# Altium schematic sheet WiFi Camera Rev 3.1.SchDoc: WiFI Camera
size A2; Revision: Rev 3.1; SheetNumber: 1
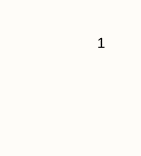
[diagram p0: WiFi Camera Rev 3.1.SchDoc, top right]
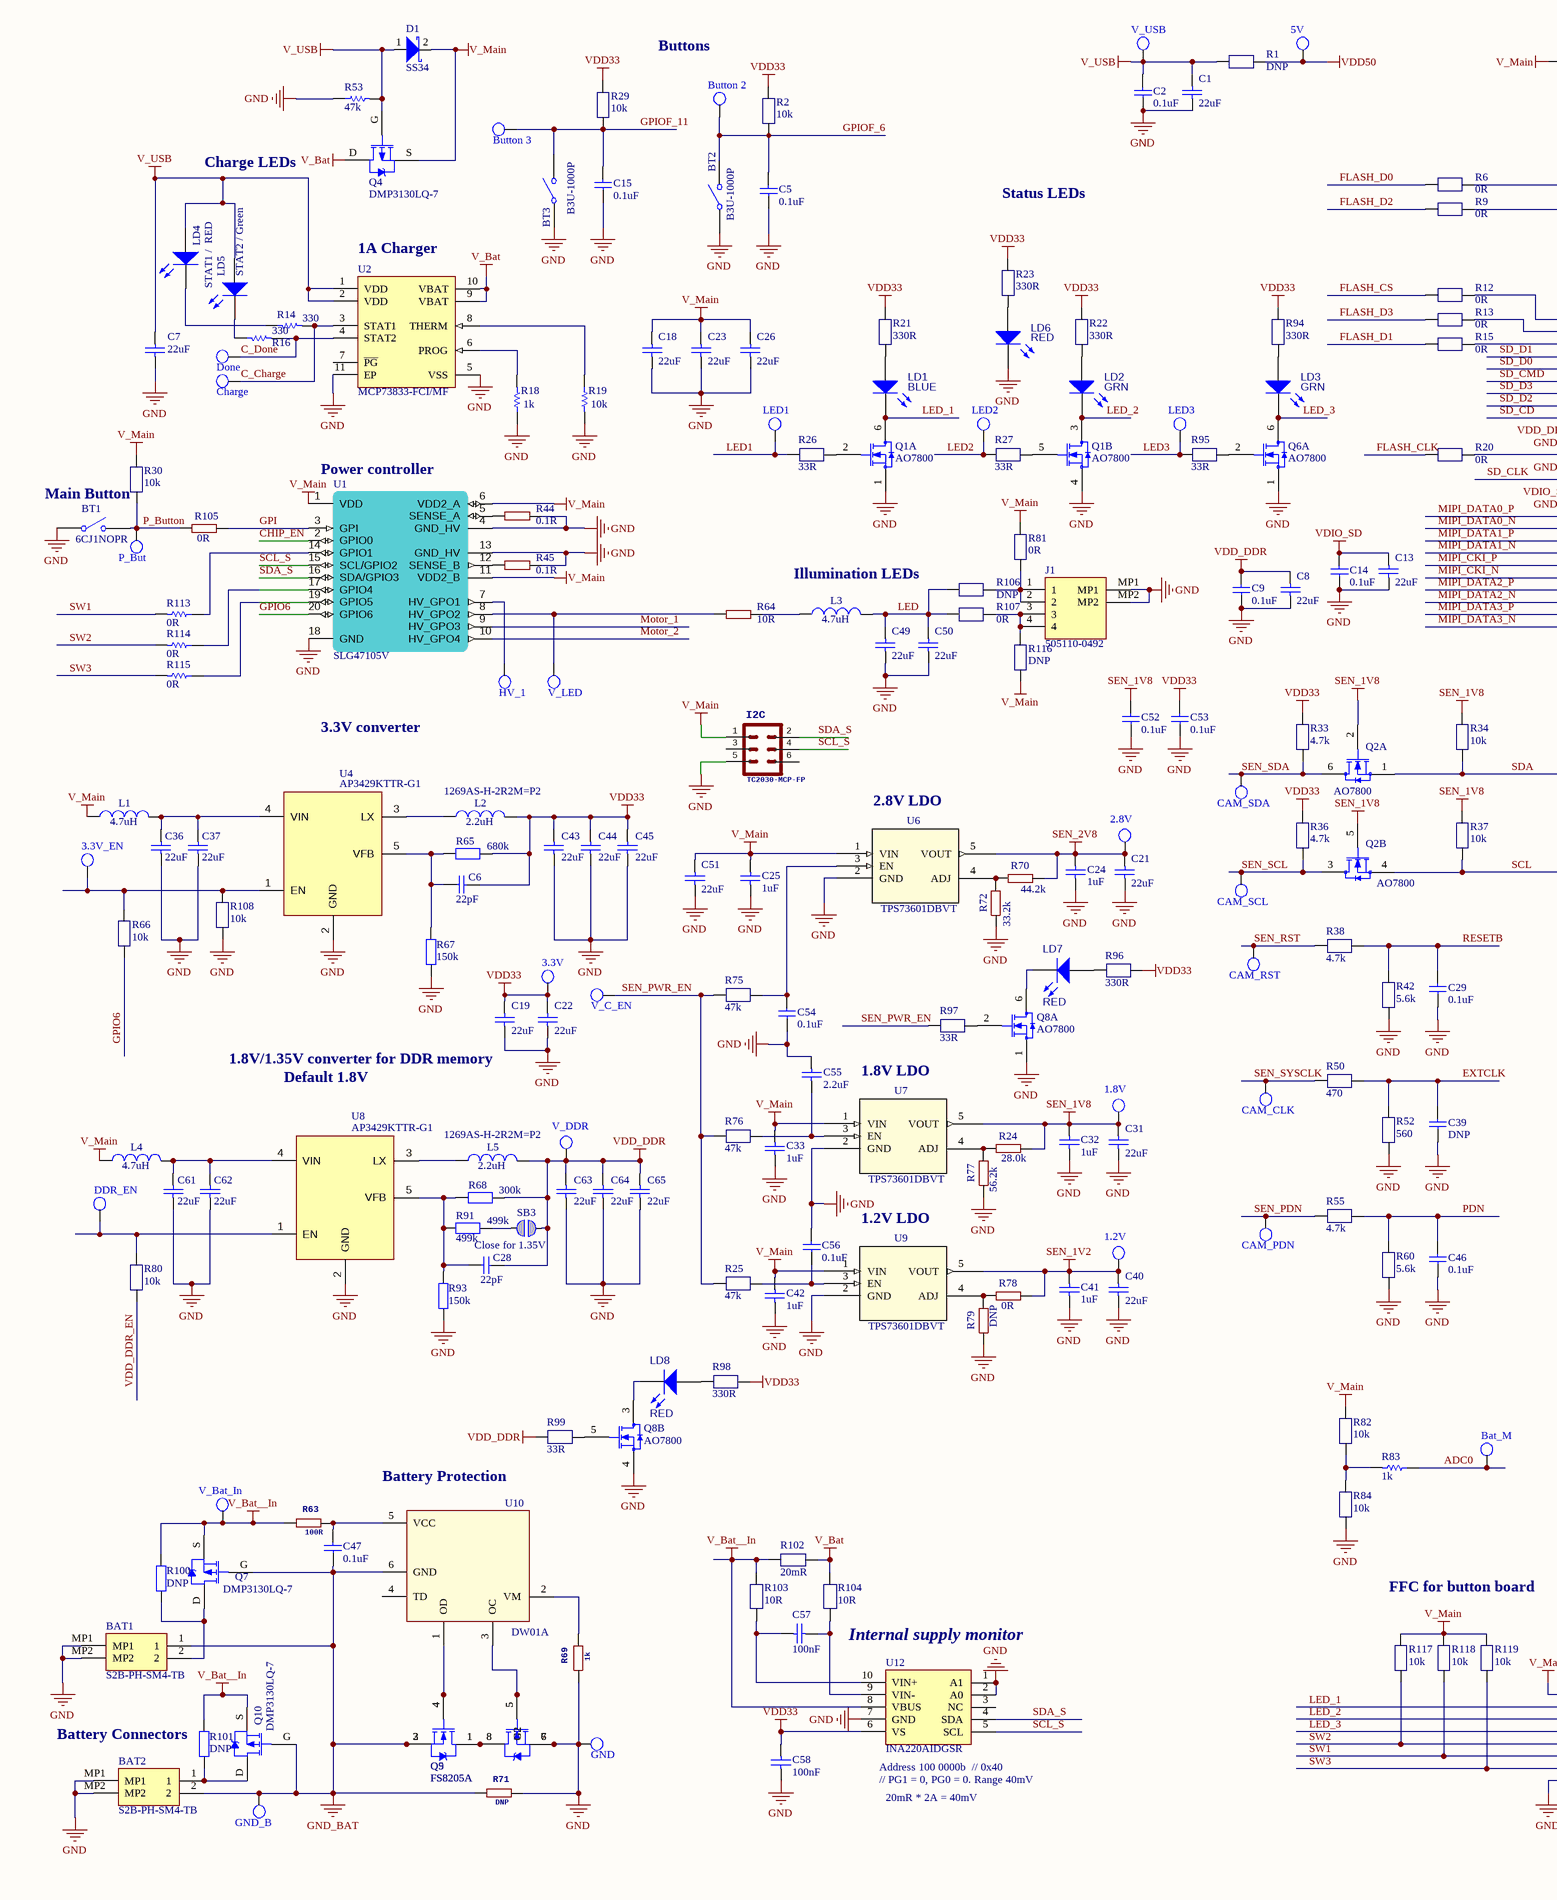
[diagram p1: WiFi Camera Rev 3.1.SchDoc, bottom left]
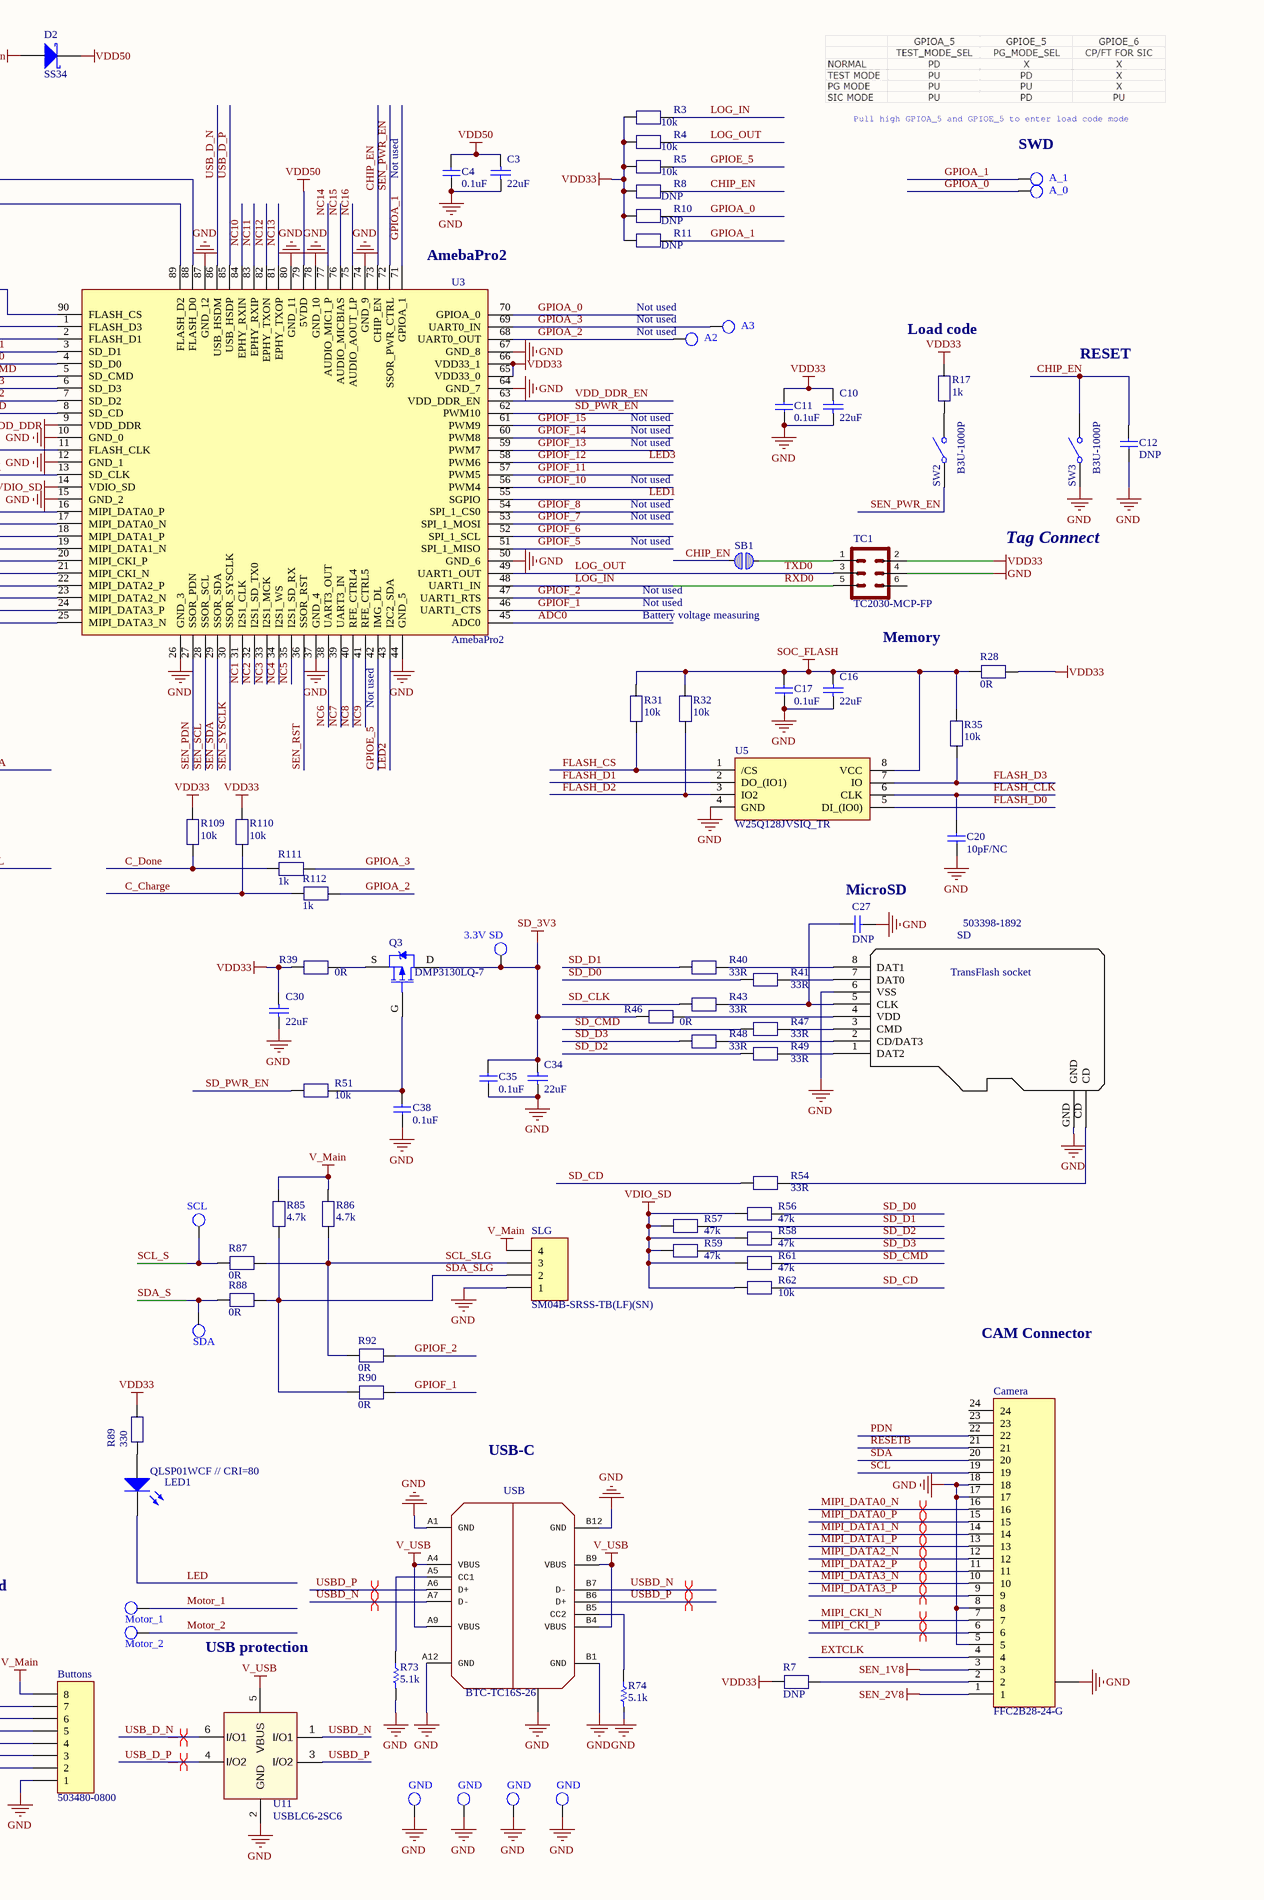
[diagram p2: WiFi Camera Rev 3.1.SchDoc, bottom middle]

## Parts
BAT1  S2B-PH-SM4-TB  [S2B-PH-SM4-TB]
BAT2  S2B-PH-SM4-TB  [S2B-PH-SM4-TB]
BT1  6CJ1NOPR  [Ultranavi_10S]
BT2  B3U-1000P  [B3U-1000P]
BT3  B3U-1000P  [B3U-1000P]
Buttons  503480-0800  [503480-0800]
C1  22uF  [CAPC1608X100N]
C2  0.1uF  [CAPC1608X100N]
C3  22uF  [CAPC1608X100N]
C4  0.1uF  [CAPC1608X100N]
C5  0.1uF  [CAPC1608X100N]
C6  22pF  [CAPC1608X100N]
C7  22uF  [CAPC1608X100N]
C8  22uF  [CAPC1608X100N]
C9  0.1uF  [CAPC1608X100N]
C10  22uF  [CAPC1608X100N]
C11  0.1uF  [CAPC1608X100N]
C12  DNP  [CAPC1608X100N]
C13  22uF  [CAPC1608X100N]
C14  0.1uF  [CAPC1608X100N]
C15  0.1uF  [CAPC1608X100N]
C16  22uF  [CAPC1608X100N]
C17  0.1uF  [CAPC1608X100N]
C18  22uF  [CAPC1608X100N]
C19  22uF  [CAPC1608X100N]
C20  10pF/NC  [CAPC1608X100N]
C21  22uF  [CAPC1608X100N]
C22  22uF  [CAPC1608X100N]
C23  22uF  [CAPC1608X100N]
C24  value 1uF  [CAPC1608X100N]  (hidden comment: C)
C25  value 1uF  [CAPC1608X100N]  (hidden comment: C)
C26  22uF  [CAPC1608X100N]
C27  DNP  [CAPC1608X100N]
C28  22pF  [CAPC1608X100N]
C29  0.1uF  [CAPC1608X100N]
C30  22uF  [CAPC1608X100N]
C31  22uF  [CAPC1608X100N]
C32  value 1uF  [CAPC1608X100N]  (hidden comment: C)
C33  value 1uF  [CAPC1608X100N]  (hidden comment: C)
C34  22uF  [CAPC1608X100N]
C35  0.1uF  [CAPC1608X100N]
C36  22uF  [CAPC1608X100N]
C37  22uF  [CAPC1608X100N]
C38  0.1uF  [CAPC1608X100N]
C39  DNP  [CAPC1608X100N]
C40  22uF  [CAPC1608X100N]
C41  value 1uF  [CAPC1608X100N]  (hidden comment: C)
C42  value 1uF  [CAPC1608X100N]  (hidden comment: C)
C43  22uF  [CAPC1608X100N]
C44  22uF  [CAPC1608X100N]
C45  22uF  [CAPC1608X100N]
C46  0.1uF  [CAPC1608X100N]
C47  0.1uF  [CAPC1608X100N]
C49  22uF  [CAPC1608X100N]
C50  22uF  [CAPC1608X100N]
C51  22uF  [CAPC1608X100N]
C52  0.1uF  [CAPC1608X100N]
C53  0.1uF  [CAPC1608X100N]
C54  0.1uF  [CAPC1608X100N]
C55  2.2uF  [CAPC1608X100N]
C56  0.1uF  [CAPC1608X100N]
C57  100nF  [CAPC1608X100N]
C58  100nF  [CAPC1608X100N]
C61  22uF  [CAPC1608X100N]
C62  22uF  [CAPC1608X100N]
C63  22uF  [CAPC1608X100N]
C64  22uF  [CAPC1608X100N]
C65  22uF  [CAPC1608X100N]
Camera  FFC2B28-24-G  [FPC-SMD_24P-P0.50_L6.4-W15.1]
D1  SS34  [DIOM5127X229N]
D2  SS34  [DIOM5127X229N]
I2C  TC2030-MCP-FP  [TC2030-MCP-FP]
J1  505110-0492  [5051100492]
L1  4.7uH  [INDC3216X130N]
L2  2.2uH  4. MAN P/N: 1269AS-H-2R2M=P2  [INDC2520X12N]
L3  4.7uH  [INDC3216X130N]
L4  4.7uH  [INDC3216X130N]
L5  2.2uH  4. MAN P/N: 1269AS-H-2R2M=P2  [INDC2520X12N]
LD1  BLUE  [LEDC1608X80N_RED]
LD2  GRN  [LEDC1608X80N_RED]
LD3  GRN  [LEDC1608X80N_RED]
LD4  value STAT1 /  RED  [LEDC1608X80N_RED]  (hidden comment: SML-D12U1WT86)
LD5  value STAT2 / Green  [LEDC1608X80N_RED]  (hidden comment: SMLE12EC6TT86)
LD6  RED  [LEDC1608X80N_RED]
LD7  RED  [LEDC1608X80N_RED]
LD8  RED  [LEDC1608X80N_RED]
LED1  QLSP01WCF // CRI=80  [QLSP01WCF]
Q1  value AO7800  [SOT65P210X110-6N]  (hidden comment: NMOS_2)  (parts A,B of 2)
Q2  value AO7800  [SOT65P210X110-6N]  (hidden comment: NMOS_2)  (parts A,B of 2)
Q3  DMP3130LQ-7  [SOT95P229X119-3N]
Q4  DMP3130LQ-7  [SOT95P229X119-3N]
Q5  FS8205A  [SOP65P640X120-8N]
Q6  value AO7800  [SOT65P210X110-6N]  (hidden comment: NMOS_2)  (part A of 2)
Q7  DMP3130LQ-7  [SOT95P229X119-3N]
Q8  value AO7800  [SOT65P210X110-6N]  (hidden comment: NMOS_2)  (parts A,B of 2)
Q9  FS8205A  [SOP65P640X120-8N]
Q10  DMP3130LQ-7  [SOT95P229X119-3N]
R1  DNP  [RESC1608X50N]
R2  10k  [RESC1608X50N]
R3  10k  [RESC1608X50N]
R4  10k  [RESC1608X50N]
R5  10k  [RESC1608X50N]
R6  0R  [RESC1608X50N]
R7  DNP  [RESC1608X50N]
R8  DNP  [RESC1608X50N]
R9  0R  [RESC1608X50N]
R10  DNP  [RESC1608X50N]
R11  DNP  [RESC1608X50N]
R12  0R  [RESC1608X50N]
R13  0R  [RESC1608X50N]
R14  value 330  [RESC1608X50N]  (hidden comment: RC0603FR-07330RL)
R15  0R  [RESC1608X50N]
R16  value 330  [RESC1608X50N]  (hidden comment: RC0603FR-07330RL)
R17  1k  [RESC1608X50N]
R18  value 1k  [RESC1608X50N]  (hidden comment: RC0603FR-071KL)
R19  value 10k  [RESC1608X50N]  (hidden comment: RC0603FR-0710KL)
R20  0R  [RESC1608X50N]
R21  330R  [RESC1608X50N]
R22  330R  [RESC1608X50N]
R23  330R  [RESC1608X50N]
R24  28.0k  [RESC1608X50N]
R25  47k  [RESC1608X50N]
R26  33R  [RESC1608X50N]
R27  33R  [RESC1608X50N]
R28  0R  [RESC1608X50N]
R29  10k  [RESC1608X50N]
R30  10k  [RESC1608X50N]
R31  10k  [RESC1608X50N]
R32  10k  [RESC1608X50N]
R33  4.7k  [RESC1608X50N]
R34  10k  [RESC1608X50N]
R35  10k  [RESC1608X50N]
R36  4.7k  [RESC1608X50N]
R37  10k  [RESC1608X50N]
R38  4.7k  [RESC1608X50N]
R39  0R  [RESC1608X50N]
R40  33R  [RESC1608X50N]
R41  33R  [RESC1608X50N]
R42  5.6k  [RESC1608X50N]
R43  33R  [RESC1608X50N]
R44  0.1R  [RESC2012X50N]
R45  0.1R  [RESC2012X50N]
R46  0R  [RESC1608X50N]
R47  33R  [RESC1608X50N]
R48  33R  [RESC1608X50N]
R49  33R  [RESC1608X50N]
R50  470  [RESC1608X50N]
R51  10k  [RESC1608X50N]
R52  560  [RESC1608X50N]
R53  47k  [RESC1608X50N]
R54  33R  [RESC1608X50N]
R55  4.7k  [RESC1608X50N]
R56  47k  [RESC1608X50N]
R57  47k  [RESC1608X50N]
R58  47k  [RESC1608X50N]
R59  47k  [RESC1608X50N]
R60  5.6k  [RESC1608X50N]
R61  47k  [RESC1608X50N]
R62  10k  [RESC1608X50N]
R63  100R  [RESC1608X50N]
R64  10R  [RESC3216X70N]
R65  680k  [RESC1608X50N]
R66  10k  [RESC1608X50N]
R67  150k  [RESC1608X50N]
R68  300k  [RESC1608X50N]
R69  1k  [RESC1608X50N]
R70  44.2k  [RESC1608X50N]
R71  DNP  [RESC1608X50N]
R72  33.2k  [RESC1608X50N]
R73  5.1k  [RESC1608X50N]
R74  5.1k  [RESC1608X50N]
R75  47k  [RESC1608X50N]
R76  47k  [RESC1608X50N]
R77  56.2k  [RESC1608X50N]
R78  0R  [RESC1608X50N]
R79  DNP  [RESC1608X50N]
R80  10k  [RESC1608X50N]
R81  0R  [RESC1608X50N]
R82  10k  [RESC1608X50N]
R83  value 1k  [RESC1608X50N]  (hidden comment: RC0603FR-071KL)
R84  10k  [RESC1608X50N]
R85  4.7k  [RESC1608X50N]
R86  4.7k  [RESC1608X50N]
R87  0R  [RESC1608X50N]
R88  0R  [RESC1608X50N]
R89  330  [RESC1608X50N]
R90  0R  [RESC1608X50N]
R91  499k  [RESC1608X50N]
R92  0R  [RESC1608X50N]
R93  150k  [RESC1608X50N]
R94  330R  [RESC1608X50N]
R95  33R  [RESC1608X50N]
R96  330R  [RESC1608X50N]
R97  33R  [RESC1608X50N]
R98  330R  [RESC1608X50N]
R99  33R  [RESC1608X50N]
R100  DNP  [RESC1608X50N]
R101  DNP  [RESC1608X50N]
R102  20mR  [RESC1608X50N]
R103  10R  [RESC1608X50N]
R104  10R  [RESC1608X50N]
R105  0R  [RESC1608X50N]
R106  DNP  [RESC1608X50N]
R107  0R  [RESC1608X50N]
R108  10k  [RESC1608X50N]
R109  10k  [RESC1608X50N]
R110  10k  [RESC1608X50N]
R111  1k  [RESC1608X50N]
R112  1k  [RESC1608X50N]
R113  0R  [RESC1608X50N]
R114  0R  [RESC1608X50N]
R115  0R  [RESC1608X50N]
R116  DNP  [RESC1608X50N]
R117  10k  [RESC1608X50N]
R118  10k  [RESC1608X50N]
R119  10k  [RESC1608X50N]
SB1  (no value)  [Solderbridge]  (no BOM)
SB3  Close for 1.35V  [Solderbridge]  (no BOM)
SD  503398-1892  [503398-1892]
SLG  SM04B-SRSS-TB(LF)(SN)  [SM04B-SRSS-TB(LF)(SN)]
SW2  B3U-1000P  [B3U-1000P]
SW3  B3U-1000P  [B3U-1000P]
TC1  TC2030-MCP-FP  [TC2030-MCP-FP]
TP1  V_USB  [Test_PAD]
TP2  5V  [Test_PAD]
TP3  Button 2  [Test_PAD]
TP4  Button 3  [Test_PAD]
TP5  Done  [Test_PAD]
TP6  Charge  [Test_PAD]
TP7  LED1  [Test_PAD]
TP8  LED2  [Test_PAD]
TP9  P_But  [Test_PAD]
TP10  HV_1  [Test_PAD]
TP11  V_LED  [Test_PAD]
TP12  A_1  [Test_PAD]
TP13  A_0  [Test_PAD]
TP14  3.3V  [Test_PAD]
TP15  CAM_SDA  [Test_PAD]
TP16  2.8V  [Test_PAD]
TP17  CAM_SCL  [Test_PAD]
TP18  3.3V SD  [Test_PAD]
TP19  V_C_EN  [Test_PAD]
TP20  CAM_RST  [Test_PAD]
TP21  Motor_1  [Test_PAD]
TP22  A2  [Test_PAD]
TP23  A3  [Test_PAD]
TP24  DDR_EN  [Test_PAD]
TP25  1.2V  [Test_PAD]
TP26  CAM_PDN  [Test_PAD]
TP27  SCL  [Test_PAD]
TP28  SDA  [Test_PAD]
TP29  GND  [Test_PAD]
TP30  GND  [Test_PAD]
TP31  GND  [Test_PAD]
TP32  GND  [Test_PAD]
TP33  Bat_M  [Test_PAD]
TP34  Motor_2  [Test_PAD]
TP36  GND_B  [Test_PAD]
TP37  V_Bat_In  [Test_PAD]
TP38  GND  [Test_PAD]
TP39  3.3V_EN  [Test_PAD]
TP40  LED3  [Test_PAD]
TP49  V_DDR  [Test_PAD]
TP50  CAM_CLK  [Test_PAD]
TP55  1.8V  [Test_PAD]
U1  SLG47105V  [STQFN-20-2.0X3.0-C]
U2  MCP73833-FCI/MF  [DFN-MF10]
U3  AmebaPro2  [MODULE90-20X27.5]
U4  AP3429KTTR-G1  [SOT95P280X110-5N]
U5  W25Q128JVSIQ_TR  [SOIC127P780X195-8N]
U6  TPS73601DBVT  [SOT95P280X140-5N]
U7  TPS73601DBVT  [SOT95P280X140-5N]
U8  AP3429KTTR-G1  [SOT95P280X110-5N]
U9  TPS73601DBVT  [SOT95P280X140-5N]
U10  DW01A  [SOT95P280X145-6N]
U11  USBLC6-2SC6  [SOT95P280X100-6N]
U12  INA220AIDGSR  [SOP50P490X110-10N]
USB  BTC-TC16S-26  [USB-C-SMD_DGBZ_BTC-TC16S-26]

## Nets
GND: BAT1.MP1 BAT1.MP2 BAT2.MP1 BAT2.MP2 BT1.1(COMMON) BT2.1(COMMON) BT3.1(COMMON) Buttons.1 C1.2 C2.2 C3.2 C4.2 C5.2 C7.1 C8.2 C9.2 C10.2 C11.2 C12.2 C13.2 C14.2 C15.2 C16.2 C17.2 C18.2 C19.2 C20.2 C21.2 C22.2 C23.2 C24.1 C25.1 C26.2 C27.2 C29.2 C30.2 C31.2 C32.1 C33.1 C34.2 C35.2 C36.1 C37.1 C38.2 C39.2 C40.2 C41.1 C42.1 C43.2 C44.2 C45.2 C46.2 C49.2 C50.2 C51.2 C52.2 C53.2 C54.2 C55.2 C56.1 C58.1 C61.1 C62.1 C63.2 C64.2 C65.2 Camera.0 Camera.5 Camera.8 Camera.17 Camera.18 I2C.5 J1.MP1 J1.MP2 LD6.2(K) Q1.1(S1) Q1.4(S2) Q5.6(S2) Q5.7(S2) Q6.1(S1) Q8.1(S1) Q8.4(S2) Q9.6(S2) Q9.7(S2) R18.1 R19.2 R42.2 R44.2 R45.2 R52.2 R53.1 R60.2 R67.2 R69.1 R71.2 R72.1 R73.2 R74.2 R77.1 R79.1 R84.2 R93.2 R108.2 SD.6(VSS) SD.GND SLG.0 SLG.1 SW3.1(COMMON) TC1.4 TP29.1 TP30.1 TP31.1 TP32.1 TP38.1 U1.4(GND_HV) U1.13(GND_HV) U1.18(GND) U1.TP U2.5(VSS) U2.11(EP) U3.10(GND_0) U3.12(GND_1) U3.15(GND_2) U3.26(GND_3) U3.37(GND_4) U3.44(GND_5) U3.50(GND_6) U3.64(GND_7) U3.67(GND_8) U3.74(GND_9) U3.78(GND_10) U3.80(GND_11) U3.87(GND_12) U4.2(GND) U5.4(GND) U6.2(GND) U7.2(GND) U8.2(GND) U9.2(GND) U11.2(GND) U12.1(A1) U12.2(A0) U12.7(GND) USB.A1(GND) USB.A12(GND) USB.B1(GND) USB.B12(GND) USB.SH
GND_BAT: BAT1.1 BAT2.2 C47.2 Q5.2(S1) Q5.3(S1) Q7.G Q9.2(S1) Q9.3(S1) Q10.G R71.1 TP36.1 U10.6(GND)
SD_3V3: C34.1 C35.1 Q3.D R46.2 TP18.1
SEN_1V2: C40.1 C41.2 R78.2 TP25.1 U9.5(VOUT)
SEN_1V8: C31.1 C32.2 C52.1 Camera.3 Q2.2(G1) Q2.5(G2) R24.2 R34.2 R37.2 TP55.1 U7.5(VOUT)
SEN_2V8: C21.1 C24.2 Camera.1 R70.2 TP16.1 U6.5(VOUT)
SOC_FLASH: C16.1 C17.1 R28.2 R31.1 R32.1 R35.1 U5.8(VCC)
V_Bat: Q4.D R102.1 R104.2 U2.9(VBAT) U2.10(VBAT)
V_Bat__In: Q7.S Q10.S R63.1 R100.1 R101.1 R102.2 R103.2 TP37.1 U12.8(VBUS)
V_Main: Buttons.8 C18.1 C23.1 C25.2 C26.1 C33.2 C42.2 C51.1 D1.2(K) D2.1(A) I2C.1 L1.1 L4.1 Q4.S R30.1 R81.2 R82.1 R85.2 R86.2 R116.1 R117.1 R118.1 R119.1 SLG.4 U1.1(VDD) U1.6(VDD2_A) U1.11(VDD2_B) U6.1(VIN) U7.1(VIN) U9.1(VIN)
V_USB: C1.1 C2.1 C7.2 D1.1(A) LD4.1(A) LD5.1(A) Q4.G R1.1 R53.2 TP1.1 U2.1(VDD) U2.2(VDD) U11.5(VBUS) USB.A4(VBUS) USB.A9(VBUS) USB.B4(VBUS) USB.B9(VBUS)
VDD33: C6.2 C10.1 C11.1 C19.1 C22.1 C30.1 C43.1 C44.1 C45.1 C53.1 C58.2 L2.2 R2.1 R3.2 R4.2 R5.2 R7.2 R8.2 R10.2 R11.2 R17.1 R21.2 R22.2 R23.2 R28.1 R29.1 R33.2 R36.2 R39.2 R65.2 R89.1 R94.2 R96.2 R98.2 R109.2 R110.2 TC1.2 TP14.1 U3.65(VDD33_0) U3.66(VDD33_1) U12.6(VS)
VDD50: C3.1 C4.1 D2.2(K) R1.2 TP2.1 U3.79(5VDD)
VDD_DDR: C8.1 C9.1 C28.2 C63.1 C64.1 C65.1 L5.2 R68.2 R99.2 SB3.1 TP49.1 U3.9(VDD_DDR)
VDIO_SD: C13.1 C14.1 R56.1 R57.1 R58.1 R59.1 R61.1 R62.1 U3.14(VDIO_SD)
ADC0: R83.1 TP33.1 U3.45(ADC0)
C_Charge: R14.2 R110.1 R112.1 TP6.1 U2.3(STAT1)
C_Done: R16.2 R109.1 R111.1 TP5.1 U2.4(STAT2)
CHIP_EN: C12.1 R8.1 SB1.2 SW3.2(NO) U1.2(GPIO0) U3.73(CHIP_EN)
EXTCLK: C39.1 Camera.4 R50.1 R52.1
FLASH_CLK: C20.1 R20.1 U5.6(CLK)
FLASH_CS: R12.1 R31.2 U5.1(/CS)
FLASH_D0: R6.1 U5.5(DI_(IO0))
FLASH_D1: R15.1 U5.2(DO_(IO1))
FLASH_D2: R9.1 R32.2 U5.3(IO2)
FLASH_D3: R13.1 R35.2 U5.7(IO)
GPI: R105.2 U1.3(GPI)
GPIO6: R66.1 U1.20(GPIO6)
GPIOA_0: R10.1 TP13.1 U3.70(GPIOA_0)
GPIOA_1: R11.1 TP12.1 U3.71(GPIOA_1)
GPIOA_2: R112.2 TP22.1 U3.68(UART0_OUT)
GPIOA_3: R111.2 TP23.1 U3.69(UART0_IN)
GPIOE_5: R5.1 U3.42(IMG_DL)
GPIOF_1: R90.1 U3.46(UART1_CTS)
GPIOF_2: R92.1 U3.47(UART1_RTS)
GPIOF_5: U3.51(SPI_1_MISO)
GPIOF_6: BT2.2(NO) C5.1 R2.2 TP3.1 U3.52(SPI_1_SCL)
GPIOF_7: U3.53(SPI_1_MOSI)
GPIOF_8: U3.54(SPI_1_CS0)
GPIOF_10: U3.56(PWM4)
GPIOF_11: BT3.2(NO) C15.1 R29.2 TP4.1 U3.57(PWM5)
GPIOF_12: R95.2 TP40.1 U3.58(PWM6)  [also labelled LED3]
GPIOF_13: U3.59(PWM7)
GPIOF_14: U3.60(PWM8)
GPIOF_15: U3.61(PWM9)
LED: C49.1 C50.1 L3.2 LED1.2(K) R106.1 R107.1
LED1: R26.2 TP7.1 U3.55(SGPIO)
LED2: R27.2 TP8.1 U3.43(I2C2_SDA)
LED_1: Buttons.7 LD1.2(K) Q1.6(D1)
LED_2: Buttons.6 LD2.2(K) Q1.3(D2)
LED_3: Buttons.5 LD3.2(K) Q6.6(D1)
LOG_IN: R3.1 TC1.5 U3.48(UART1_IN)  [also labelled RXD0]
LOG_OUT: R4.1 TC1.3 U3.49(UART1_OUT)  [also labelled TXD0]
MIPI_CKI_N: Camera.7 U3.21(MIPI_CKI_N)
MIPI_CKI_P: Camera.6 U3.20(MIPI_CKI_P)
MIPI_DATA0_N: Camera.16 U3.17(MIPI_DATA0_N)
MIPI_DATA0_P: Camera.15 U3.16(MIPI_DATA0_P)
MIPI_DATA1_N: Camera.14 U3.19(MIPI_DATA1_N)
MIPI_DATA1_P: Camera.13 U3.18(MIPI_DATA1_P)
MIPI_DATA2_N: Camera.12 U3.23(MIPI_DATA2_N)
MIPI_DATA2_P: Camera.11 U3.22(MIPI_DATA2_P)
MIPI_DATA3_N: Camera.10 U3.25(MIPI_DATA3_N)
MIPI_DATA3_P: Camera.9 U3.24(MIPI_DATA3_P)
Motor_1: TP21.1 U1.9(HV_GPO3)
Motor_2: TP34.1 U1.10(HV_GPO4)
NC1: U3.31(I2S1_CLK)
NC2: U3.32(I2S1_SD_TX0)
NC3: U3.33(I2S1_MCK)
NC4: U3.34(I2S1_WS)
NC5: U3.35(I2S1_SD_RX)
NC6: U3.38(UART3_OUT)
NC7: U3.39(UART3_IN)
NC8: U3.40(RFE_CTRL4)
NC9: U3.41(RFE_CTRL5)
NC10: U3.84(EPHY_RXIN)
NC11: U3.83(EPHY_RXIP)
NC12: U3.82(EPHY_TXON)
NC13: U3.81(EPHY_TXOP)
NC14: U3.77(AUDIO_MIC1_P)
NC15: U3.76(AUDIO_MICBIAS)
NC16: U3.75(AUDIO_AOUT_LP)
P_Button: BT1.2(NO) R30.2 R105.1 TP9.1
PDN: C46.1 Camera.22 R55.1 R60.1
RESETB: C29.1 Camera.21 R38.1 R42.1
SCL: Camera.19 Q2.4(S2) R37.1
SCL_S: I2C.4 R87.2 TP27.1 U1.15(SCL/GPIO2) U12.5(SCL)
SCL_SLG: R86.1 R87.1 R92.2 SLG.3
SD_CD: R54.1 R62.2 U3.8(SD_CD)
SD_CLK: R43.1 U3.13(SD_CLK)
SD_CMD: R47.1 R61.2 U3.5(SD_CMD)
SD_D0: R41.1 R56.2 U3.4(SD_D0)
SD_D1: R40.1 R57.2 U3.3(SD_D1)
SD_D2: R49.1 R58.2 U3.7(SD_D2)
SD_D3: R48.1 R59.2 U3.6(SD_D3)
SD_PWR_EN: R51.1 U3.62(PWM10)
SDA: Camera.20 Q2.1(S1) R34.1
SDA_S: I2C.2 R88.2 TP28.1 U1.16(SDA/GPIO3) U12.4(SDA)
SDA_SLG: R85.1 R88.1 R90.2 SLG.2
SEN_PDN: R55.2 TP26.1 U3.27(SSOR_PDN)
SEN_PWR_EN: R25.2 R75.2 R76.2 R97.2 SW2.1(COMMON) TP19.1 U3.72(SSOR_PWR_CTRL)
SEN_RST: R38.2 TP20.1 U3.36(SSOR_RST)
SEN_SCL: Q2.3(D2) R36.1 TP17.1 U3.28(SSOR_SCL)
SEN_SDA: Q2.6(D1) R33.1 TP15.1 U3.29(SSOR_SDA)
SEN_SYSCLK: R50.2 TP50.1 U3.30(SSOR_SYSCLK)
SW1: Buttons.3 R113.2 R118.2
SW2: Buttons.4 R114.2 R117.2
SW3: Buttons.2 R115.2 R119.2
USB_D_N: U3.86(USB_HSDM) U11.6(I/O1)
USB_D_P: U3.85(USB_HSDP) U11.4(I/O2)
USBD_N: U11.1(I/O1) USB.A7(D-) USB.B7(D-)
USBD_P: U11.3(I/O2) USB.A6(D+) USB.B6(D+)
VDD_DDR_EN: R80.1 U3.63(VDD_DDR_EN)
NetBAT1_2: BAT1.2 Q7.D R100.2
NetBAT2_1: BAT2.1 Q10.D R101.2
NetC6_1: C6.1 R65.1 R67.1 U4.5(VFB)
NetC27_1: C27.1 R43.2 SD.5(CLK)
NetC28_1: C28.1 R68.1 R91.1 R93.1 U8.5(VFB)
NetC36_2: C36.2 C37.2 L1.2 U4.4(VIN)
NetC38_1: C38.1 Q3.G R51.2
NetC47_1: C47.1 R63.2 U10.5(VCC)
NetC54_1: C54.1 R75.1 U6.3(EN)
NetC55_1: C55.1 R76.1 U7.3(EN)
NetC56_2: C56.2 R25.1 U9.3(EN)
NetC57_1: C57.1 R104.1 U12.9(VIN-)
NetC57_2: C57.2 R103.1 U12.10(VIN+)
NetC61_2: C61.2 C62.2 L4.2 U8.4(VIN)
NetCamera_2: Camera.2 R7.1
NetJ1_1: J1.1 J1.2 R81.1 R106.2
NetJ1_3: J1.3 J1.4 R107.2 R116.2
NetL2_1: L2.1 U4.3(LX)
NetL3_1: L3.1 R64.2
NetL5_1: L5.1 U8.3(LX)
NetLD1_1: LD1.1(A) R21.1
NetLD2_1: LD2.1(A) R22.1
NetLD3_1: LD3.1(A) R94.1
NetLD4_2: LD4.2(K) R14.1
NetLD5_2: LD5.2(K) R16.1
NetLD6_1: LD6.1(A) R23.1
NetLD7_1: LD7.1(A) R96.1
NetLD7_2: LD7.2(K) Q8.6(D1)
NetLD8_1: LD8.1(A) R98.1
NetLD8_2: LD8.2(K) Q8.3(D2)
NetLED1_1: LED1.1(A) R89.2
NetQ1_2: Q1.2(G1) R26.1
NetQ1_5: Q1.5(G2) R27.1
NetQ3_S: Q3.S R39.1
NetQ5_1: Q5.1(D12) Q5.8(D12) Q9.1(D12) Q9.8(D12)
NetQ5_4: Q5.4(G1) Q9.4(G1) U10.1(OD)
NetQ5_5: Q5.5(G2) Q9.5(G2) U10.3(OC)
NetQ6_2: Q6.2(G1) R95.1
NetQ8_2: Q8.2(G1) R97.1
NetQ8_5: Q8.5(G2) R99.1
NetR6_2: R6.2 U3.88(FLASH_D0)
NetR9_2: R9.2 U3.89(FLASH_D2)
NetR12_2: R12.2 U3.90(FLASH_CS)
NetR13_2: R13.2 U3.1(FLASH_D3)
NetR15_2: R15.2 U3.2(FLASH_D1)
NetR17_2: R17.2 SW2.2(NO)
NetR18_2: R18.2 U2.6(PROG)
NetR19_1: R19.1 U2.8(THERM)
NetR20_2: R20.2 U3.11(FLASH_CLK)
NetR24_1: R24.1 R77.2 U7.4(ADJ)
NetR40_2: R40.2 SD.8(DAT1)
NetR41_2: R41.2 SD.7(DAT0)
NetR44_1: R44.1 U1.5(SENSE_A)
NetR45_1: R45.1 U1.12(SENSE_B)
NetR46_1: R46.1 SD.4(VDD)
NetR47_2: R47.2 SD.3(CMD)
NetR48_2: R48.2 SD.2(CD/DAT3)
NetR49_2: R49.2 SD.1(DAT2)
NetR54_2: R54.2 SD.CD
NetR64_1: R64.1 TP11.1 U1.8(HV_GPO2)
NetR66_2: R66.2 R108.1 TP39.1 U4.1(EN)
NetR69_2: R69.2 U10.2(VM)
NetR70_1: R70.1 R72.2 U6.4(ADJ)
NetR73_1: R73.1 USB.A5(CC1)
NetR74_1: R74.1 USB.B5(CC2)
NetR78_1: R78.1 R79.2 U9.4(ADJ)
NetR80_2: R80.2 TP24.1 U8.1(EN)
NetR82_2: R82.2 R83.2 R84.1
NetR91_2: R91.2 SB3.2
NetR113_1: R113.1 U1.14(GPIO1)
NetR114_1: R114.1 U1.17(GPIO4)
NetR115_1: R115.1 U1.19(GPIO5)
NetSB1_1: SB1.1 TC1.1
NetTP10_1: TP10.1 U1.7(HV_GPO1)

Not connected (* = marked no-connect by the designer): Camera 23 24; I2C 3 6; TC1 6; U2 7(~{PG}); U10 4(TD); U12 3(NC)

## Layout directives
differential pair: MIPI_CKI_N, MIPI_CKI_P, MIPI_DATA0_N, MIPI_DATA0_P, MIPI_DATA1_N, MIPI_DATA1_P, MIPI_DATA2_N, MIPI_DATA2_P, MIPI_DATA3_N, MIPI_DATA3_P, USB_D_N, USB_D_P, USBD_N, USBD_P

## Notes on the sheet
- 1
- Buttons
- Charge LEDs
- Status LEDs
- Not used
- SWD
- (near U2) 1A Charger
- (near U3) AmebaPro2
- (near TP22) Not used
- (near R17) Load code
- RESET
- (near R30) Main Button
- (near U1) Power controller
- Illumination LEDs
- (near TC1) Tag Connect
- Battery voltage measuring
- Memory
- 3.3V converter
- (near U3) Not used
- (near U6) 2.8V LDO
- (near C27) MicroSD
- (near C19) 1.8V/1.35V converter for DDR memory
- Default 1.8V
- 1.8V LDO
- 1.2V LDO
- CAM Connector
- Battery Protection
- USB-C
- FFC for button board
- Internal supply monitor
- USB protection
- (near R101) Battery Connectors
- (near U12) Address 100 0000b  // 0x40
- (near U12) // PG1 = 0, PG0 = 0. Range 40mV
- 20mR * 2A = 40mV
- Title
- Size:
- Date:
- File:
- A2
- Number:
- Time:
- Revision:
- Sheet
- of
- (in symbol JJ TRANSFLASH) TransFlash socket

## Library data of the parts
BAT1 BAT2 = S2B-PH-SM4-TB_LF__SN_: Connector; Manufacturer_Name: JST (JAPAN SOLDERLESS TERMINALS); Manufacturer_Part_Number: S2B-PH-SM4-TB(LF)(SN); Datasheet Link: https://www.jst-mfg.com/product/pdf/eng/ePH.pdf; Height: 6.6mm; Arrow Part Number: S2B-PH-SM4-TB(LF)(SN); Arrow Price/Stock: https://www.arrow.com/en/products/s2b-ph-sm4-tb-lf-sn/jst-manufacturing?region=europe
BT1 = SW-SPST: 2.5mm 1.6mm Round Button 50mA Brick nogging 3mm SPST 12V SMD,2.5x3mm  Tactile Switches ROHS; Manufacturer Part Number: B3U-1000P; Supplier 1: LCSC; Supplier Part Number 1: C231329
BT2 BT3 SW2 SW3 = SW-SPST: 2.5mm 1.6mm Round Button 50mA Brick nogging 3mm SPST 12V SMD,2.5x3mm  Tactile Switches ROHS; Manufacturer Part Number: B3U-1000P; Supplier 1: LCSC; Supplier Part Number 1: C231329
Buttons = Header 8: Header, 8-Pin; LatestRevisionDate: 17-Jul-2002; LatestRevisionNote: Re-released for DXP Platform.; Publisher: Altium Limited
C1 C3 C8 C10 C13 C16 C18 C19 C21-C23 C26 C30 C31 C34 C40 C49-C51 = CAP: Capacitor; 6. MANUF INST: ALTERNATIVE; 2. VALUE: MLCC 100nF 25V 10% X7R; 3. MAN BRAND: Murata; 4. MAN P/N: GCJ188R71E104KA12D; 7. PACKAGE: 0603; 8. PINS: 2; 9. TYPE: SMD; 5. DATASHEET LINK: https://www.mouser.com/datasheet/2/281/c03e-516224.pdf
C2 C4 C5 C9 C11 C14 C15 C17 C29 C35 C38 C39 C46 C47 C52-C54 C56 = C0201-100n: Capacitor, X5R, ±10%; Manufacturer 1: Samsung; MFG P/N: CL05B104KO5NNNC; Description 1: Cap Ceramic 0.1uF 16V X7R 10% Pad SMD 0402 125C T/R; Material: Ceramic; Capacitance: 100nF; Dielectric: X7R; Voltage Rating: 16V; Supplier 1: Digi-Key; Supplier Part Number 1: 1276-1001-1-ND; Manufacturer Part Number 1: CL05B104KO5NNNC; Stock 1: 52857246; Pricing 1: 1=0,10000, 10=0,02400, 100=0,01070, 500=0,00766, 1000=0,00602, 2500=0,00548, 5000=0,00504 (USD); RoHS: Yes; Mount: Surface Mount; Case/Package: 0402; Case Code (Metric): 1005; Case Code (Imperial): 0402; Contact Plating: Tin; Min Operating Temperature: -55°C; Max Operating Temperature: 125°C; Tolerance: 10%; Package Quantity: 1; Packaging: Tape and Reel; Voltage: 16V; Voltage Rating (DC): 16V; Length: 1mm; Height: 0.5mm; Width: 0.02inch; Thickness: 0.022inch; Depth: 0.5mm; Radiation Hardening: No; Lead Free: Lead Free; ComponentLink1URL: https://datasheet.ciiva.com/26920/getdatasheetpartid-359683-26920169.pdf?src-supplier=Verical; ComponentLink1Description: https://datasheet.ciiva.com/26920/getdatasheetpartid-359683-26920169.pdf?src-supplier=Verical; ComponentLink2URL: https://datasheet.ciiva.com/29198/458718-da-01-en-vs-kondensator-0402-29198423.pdf?src-supplier=Conrad; ComponentLink2Description: https://datasheet.ciiva.com/29198/458718-da-01-en-vs-kondensator-0402-29198423.pdf?src-supplier=Conrad; ComponentLink3URL: https://datasheet.ciiva.com/26309/mlcc-catalogdownload2013-eng-26309003.pdf?src-supplier=Distrelec; ComponentLink3Description: https://datasheet.ciiva.com/26309/mlcc-catalogdownload2013-eng-26309003.pdf?src-supplier=Distrelec; ComponentLink4URL: https://datasheet.ciiva.com/16208/cl05b104kq5nnnc-16208343.pdf?src-supplier=Future+Electronics; ComponentLink4Description: https://datasheet.ciiva.com/16208/cl05b104kq5nnnc-16208343.pdf?src-supplier=Future+Electronics
  C2 C4 C5 C9 C11 C14 C15 C17 C29 C35 C38 C46 C47 C52-C54 C56: Value: 0.1uF
  C39: Value: DNP
C6 C12 C20 C27 C28 = C0201-100n: Capacitor, X5R, ±10%
  C6 C28: Value: 22pF
  C12: Value: DNP; Min Operating Temperature: -55°C; Width: 0.02inch; Thickness: 0.022inch
C7 = CAP: CAP CER 1UF 6.3V X5R 0603; Value: 22uF
C24 C25 C32 C33 C41 C42 C55 = 2002: CAP, CER, 1UF, 0201; MFG P/N: CC0201MRX5R6BB105; MFG: YAGEO; DASHTRONIX P/N: 2002
  C55: Value: 2.2uF
C36 C37 C43-C45 C61-C65 = CAP_10uF_0603_GRM188R61E106KA73D: Capacitor MLCC; 6. MANUF INST: ALTERNATIVE; 2. VALUE: MLCC SMD 0603 10uF 25V 10% X5R; 3. MAN BRAND: Murata; 4. MAN P/N: GRM188R61E106KA73D; 5. DATASHEET LINK: https://www.mouser.com/datasheet/2/281/murata_03052018_GRM_Series_1-1310166.pdf
C57 C58 = CAP: Value: 100nF
Camera = AYF-532435: Connector; Manufacturer_Name: Panasonic; Datasheet Link: https://www.panasonic-electric-works.com/pew/eu/downloads/ds_y5b_y5bw_en.pdf; Height: 1mm; Manufacturer_Part_Number: AYF-532435
D1 = DIODE_SK32A-LTP: 0.5mA@40V 40V Single 3A 0.55V@3A SMA(DO-214AC) Schottky Barrier Diodes; Manufacturer: MDD（Microdiode Electronics）; Supplier 1: LCSC; Supplier Part Number 1: C8678; Manufacturer Part Number: SS34
D2 = D Schottky: Schottky Diode
I2C TC1 = TC2030-CTX-NL
J1 = 505110-0492: Connector; Manufacturer_Name: Molex; Datasheet Link: https://www.molex.com/pdm_docs/sd/5051100592_sd.pdf; Height: 3.95mm; Manufacturer_Part_Number: 505110-0492; Mouser Part Number: 538-505110-0492; Mouser Price/Stock: https://www.mouser.co.uk/ProductDetail/Molex/505110-0492?qs=RawsiUxJOFQzykwKvzl6%2Fw%3D%3D; Arrow Part Number: 505110-0492; Arrow Price/Stock: https://www.arrow.com/en/products/505110-0492/molex
L1-L5 = IND_3.3uF_SHIELDED_TYA40203R3M-10: Inductor; 6. MANUF INST: ALTERNATIVE; 2. VALUE: Inductor shielded 3.3uH 3.4A 20%; 3. MAN BRAND: Laird Performance Materials; 7. PACKAGE: See Datasheet; 8. PINS: 2; 9. TYPE: SMD; 5. DATASHEET LINK: https://www.mouser.com/datasheet/2/987/Laird_Performance_TYA4012_series__Rev_A_-1877517.pdf
  L1 L3 L4: 4. MAN P/N: TYA40203R3M-10
LD1-LD3 LD6-LD8 = LED_GREEN_0603_THG1111C-0005-TR: LED; 6. MANUF INST: ALTERNATIVE; 2. VALUE: LED GREEN 100mcd; 3. MAN BRAND: Stanley; 7. PACKAGE: 0603; 8. PINS: 2; 9. TYPE: SMD; 4. MAN P/N: THG1111C-0005-TR; 5. DATASHEET LINK: https://www.mouser.com/datasheet/2/917/stanley_led_2018_02-1504930.pdf
LD4 LD5 = LED0: LED GREEN CLEAR 0603 SMD
LED1 = LED0: Typical INFRARED GaAs LED
Q1 Q2 Q6 Q8 = 4102: MOSFET 2N-CH 60V 295MA SOT363; MFG: OnSemi; DASHTRONIX P/N: 4102; MFG P/N: AO7800
Q3 Q4 Q7 Q10 = Transistor P-channel: Trans MOSFET P-CH 60V 26A 3-Pin(2+Tab) DPAK; Manufacturer Part Number: DMP3130LQ-7
Q5 Q9 = FS8205A: HEXFET Power MOSFET
R1-R13 R15 R17 R20 R25-R43 R46-R52 R54-R62 R66 R75 R76 R80-R82 R84-R88 R90 R92 R95 R97 R99 R102-R104 R106-R112 R116-R119 = Resistor
  R1 R7 R8 R10 R11 R106 R116: Value: DNP
  R2-R5 R29-R32 R34 R35 R37 R51 R62 R66 R80 R82 R84 R108-R110 R117-R119: Value: 10k
  R6 R9 R12 R13 R15 R20 R28 R39 R46 R81 R87 R88 R90 R92 R107: Value: 0R
  R17 R111 R112: Value: 1k
  R25 R56-R59 R61 R75 R76: Value: 47k
  R26 R27 R40 R41 R43 R47-R49 R54 R95 R97 R99: Value: 33R
  R33 R36 R38 R55 R85 R86: Value: 4.7k
  R42 R60: Value: 5.6k
  R50: Value: 470
  R52: Value: 560
  R102: Value: 20mR
  R103 R104: Value: 10R
R14 R16 = Res1: RES SMD 330 OHM 1% 1/10W 0603
R18 R83 R113-R115 = Res1: RES SMD 2K OHM 1% 1/10W 0603
  R113-R115: Value: 0R
R19 = Res1: RES SMD 10K OHM 1% 1/10W 0603
R21-R23 R94 R96 R98 = Resistor: Value: 330
R24 R70-R72 R77-R79 R105 = R-EU_R0402: RESISTOR, European symbol
R44 R45 R64 = R-EU_R0402: RESISTOR, European symbol; Manufacturer 1: Yageo; Manufacturer Part Number 1: RC0603FR-074K7L; Description 1: RES SMD 4.7K OHM 1% 1/10W 0603; Tolerance: 1%; Resistance: 4.7kR; Temperature Coefficient: 100ppm/°C; Power Rating: 100mW; Voltage Rating (DC): 50V; Supplier 1: Digi-Key; Supplier Part Number 1: 311-4.70KHRCT-ND; Stock 1: 16071251; Pricing 1: 1=0,10000, 10=0,02400, 100=0,00970, 1000=0,00437, 2500=0,00379 (USD); RoHS: Yes; Case/Package: 0603; Number of Pins: 2; Case Code (Imperial): 0603; Case Code (Metric): 1608; Min Operating Temperature: -55°C; Max Operating Temperature: 155°C; Composition: Thick Film; Packaging: Tape and Reel; Voltage Rating: 50V; Termination: SMD/SMT; Military Standard: Not; Length: 1.6mm; Height: 0.45mm; Width: 0.8mm; Depth: 0.8mm; Lead Pitch: 0.3mm; REACH SVHC: No SVHC; Lead Free: Lead Free; ComponentLink1URL: https://datasheet.ciiva.com/15189/getdatasheetpartid-422754-15189760.pdf?src-supplier=Verical; ComponentLink1Description: https://datasheet.ciiva.com/15189/getdatasheetpartid-422754-15189760.pdf?src-supplier=Verical; ComponentLink2URL: https://datasheet.ciiva.com/22747/443971-22747528.pdf?src-supplier=Element14; ComponentLink2Description: https://datasheet.ciiva.com/22747/443971-22747528.pdf?src-supplier=Element14; ComponentLink3URL: https://datasheet.ciiva.com/7660/38590-7660794.pdf?src-supplier=Element14; ComponentLink3Description: https://datasheet.ciiva.com/7660/38590-7660794.pdf?src-supplier=Element14; ComponentLink4URL: https://datasheet.ciiva.com/7746/1868787-7746365.pdf?src-supplier=Element14; ComponentLink4Description: https://datasheet.ciiva.com/7746/1868787-7746365.pdf?src-supplier=Element14; ComponentLink5URL: https://datasheet.ciiva.com/46440/1868787-46440909.pdf?src-supplier=Element14; ComponentLink5Description: https://datasheet.ciiva.com/46440/1868787-46440909.pdf?src-supplier=Element14; ComponentLink6URL: https://datasheet.ciiva.com/7746/1738695-7746366.pdf?src-supplier=Element14; ComponentLink6Description: https://datasheet.ciiva.com/7746/1738695-7746366.pdf?src-supplier=Element14
R53 = Res1: 125mW 150V ±100ppm/℃ ±1% -55℃~+155℃ 100kΩ 0805; Manufacturer: YAGEO; Value: 47k
R63 R69 = R-EU_R0402: RESISTOR, European symbol; Manufacturer Part Number: RC0402FR-0710KL; Manufacturer 1: Yageo; Manufacturer Part Number 1: RC0402FR-07100KL; Description 1: RES SMD 100K OHM 1% 1/16W 0402; Tolerance: 1%; Resistance: 100kR; Temperature Coefficient: 100ppm/°C; Power Rating: 63mW; Voltage Rating: 50V; NAME: *; MFG P/N: MFG P/N; Supplier 1: Digi-Key; Supplier Part Number 1: 311-100KLRCT-ND; Stock 1: 57163065; Pricing 1: 1=0,10000, 10=0,01600, 100=0,00670, 1000=0,00301, 2500=0,00261, 5000=0,00215 (USD); RoHS: Yes; Case/Package: 0402; Case Code (Metric): 1005; Case Code (Imperial): 0402; Min Operating Temperature: -55°C; Max Operating Temperature: 155°C; Composition: Thick Film; Packaging: Tape and Reel; Package Quantity: 1; Number of Terminations: 2; Termination: SMD/SMT; Military Standard: Not; Max Power Dissipation: 63mW; Working Voltage: 50V; Features: Moisture Resistant; Length: 0.039inch; Height: 0.016inch; Width: 0.02inch; Depth: 0.5mm; REACH SVHC: No SVHC; Lead Free: Lead Free; ComponentLink1URL: https://datasheet.ciiva.com/11819/0900766b80c66297-11819452.pdf?src-supplier=RSComponents; ComponentLink1Description: https://datasheet.ciiva.com/11819/0900766b80c66297-11819452.pdf?src-supplier=RSComponents; ComponentLink2URL: https://datasheet.ciiva.com/2453/pyu-r-int-thick-7-2453361.pdf?src-supplier=Digi-Key; ComponentLink2Description: https://datasheet.ciiva.com/2453/pyu-r-int-thick-7-2453361.pdf?src-supplier=Digi-Key; ComponentLink3URL: https://datasheet.ciiva.com/2453/pyu-r-int-thick-7-2453362.pdf?src-supplier=Digi-Key; ComponentLink3Description: https://datasheet.ciiva.com/2453/pyu-r-int-thick-7-2453362.pdf?src-supplier=Digi-Key; ComponentLink4URL: https://datasheet.ciiva.com/2453/pyu-r-int-thick-7-2453363.pdf?src-supplier=Digi-Key; ComponentLink4Description: https://datasheet.ciiva.com/2453/pyu-r-int-thick-7-2453363.pdf?src-supplier=Digi-Key; ComponentLink5URL: https://datasheet.ciiva.com/22747/1018594-22747509.pdf?src-supplier=Element14; ComponentLink5Description: https://datasheet.ciiva.com/22747/1018594-22747509.pdf?src-supplier=Element14; ComponentLink6URL: https://datasheet.ciiva.com/15189/getdatasheetpartid-323696-15189334.pdf?src-supplier=Verical; ComponentLink6Description: https://datasheet.ciiva.com/15189/getdatasheetpartid-323696-15189334.pdf?src-supplier=Verical; ComponentLink7URL: https://datasheet.ciiva.com/12667/pyu-rc0402-51-rohs-l-6-r-12667930.pdf?src-supplier=Mouser; ComponentLink7Description: https://datasheet.ciiva.com/12667/pyu-rc0402-51-rohs-l-6-r-12667930.pdf?src-supplier=Mouser
R65 R67 R68 R91 R93 R100 R101 = Res2: Resistor
  R65: Published: 8-Jun-2000; LatestRevisionDate: 17-Jul-2002; LatestRevisionNote: Re-released for DXP Platform.; PackageReference: AXIAL-0.4; Publisher: Altium Limited; PackageDescription: Axial Device, Thru-Hole; 2 Leads; 0.4 in Pin Spacing; Value: 680k
  R67 R93: Published: 8-Jun-2000; LatestRevisionDate: 17-Jul-2002; LatestRevisionNote: Re-released for DXP Platform.; PackageReference: AXIAL-0.4; Publisher: Altium Limited; PackageDescription: Axial Device, Thru-Hole; 2 Leads; 0.4 in Pin Spacing; Value: 150k
  R68: Published: 8-Jun-2000; LatestRevisionDate: 17-Jul-2002; LatestRevisionNote: Re-released for DXP Platform.; PackageReference: AXIAL-0.4; Publisher: Altium Limited; PackageDescription: Axial Device, Thru-Hole; 2 Leads; 0.4 in Pin Spacing
  R91: Value: 499k
  R100 R101: Published: 8-Jun-2000; LatestRevisionDate: 17-Jul-2002; LatestRevisionNote: Re-released for DXP Platform.; PackageReference: AXIAL-0.4; Publisher: Altium Limited; PackageDescription: Axial Device, Thru-Hole; 2 Leads; 0.4 in Pin Spacing; Value: DNP
R73 R74 = Res1: 125mW Thick Film Resistors 150V ±100ppm/℃ ±1% -55℃~+155℃ 10kΩ 0805; Manufacturer: UNI-ROYAL(Uniroyal Elec); Manufacturer Part Number: 0805W8F5101T5E; Supplier 1: LCSC; Supplier Part Number 1: C27834; Value: 5.1k
R89 = Resistor: MANUFACTURER P/N: RC0603JR-0710KL; MANUFACTURER: *; Value: 330
SB1 SB3 = Solderbridge
SD = JJ TRANSFLASH: Transflash Socket
SLG = Header 4: Header, 4-Pin
TP1-TP34 TP36-TP40 TP49 TP50 TP55 = TP_P0_0.8_D0: Test Point
U1 = SLG47105V: GreenPAK Programmable Mixed-Signal Matrix; Manufacturer 1: Dialog Semiconductor; Component Kind: STQFN-20-2.0X3.0-C; HelpURL: https://www.dialog-semiconductor.com/sites/default/files/2021-04/SLG47105_ds_3v1.pdf; Supplier 1: Dialog Semiconductor; Supplier Link 1: https://www.dialog-semiconductor.com/products/greenpak/slg47105#tab-field_tab_content_order; Supplier Part Number 1: *; Manufacturer Part Number 1: SLG47105V
U2 = MCP73833-FCI/MF: Stand-Alone Linear Li-Ion/Li-Polymer Charge Management Controller with Power-Good Output, 4.2V, 10-Pin DFN, Industrial Temperature
U3 = Module: Undefined or Miscellaneous
U4 U8 = IC_VOLT_REG_BUCK_TPS562200DDCT: Integrated Circuit
U5 = W25Q128JVSIQ_TR: Inductor; Manufacturer_Name: Winbond; Manufacturer_Part_Number: W25Q128JVSIQ TR; Datasheet Link: http://www.winbond.com/resource-files/w25q128jv%20spi%20revc%2011162016.pdf; Height: 1.95mm; Mouser Part Number: 454-W25Q128JVSIQTR; Mouser Price/Stock: https://www.mouser.co.uk/ProductDetail/Winbond/W25Q128JVSIQ-TR?qs=qSfuJ%252Bfl%2Fd7vTyLA9kNdGw%3D%3D; Arrow Part Number: W25Q128JVSIQ TR; Arrow Price/Stock: https://www.arrow.com/en/products/w25q128jvsiqtr/winbond-electronics?region=nac
U6 U7 U9 = 5101: IC REG LINEAR 3.3V 150MA SC70-5; MFG: Microchip; DASHTRONIX P/N: 5101; MFG P/N: MIC5365-3.3YC5-TR
U11 = Component_1: Integrated Circuit; 6. MANUF INST: ORIGINAL; 2. VALUE: USB Transient Sup SMD; 3. MAN BRAND: ST Micro; 7. PACKAGE: SOT-23-6L; 8. PINS: 6; 9. TYPE: SMD; 4. MAN P/N: USBLC6-2SC6; 5. DATASHEET LINK: https://www.mouser.com/datasheet/2/389/usblc6-2-957370.pdf
U12 = INA220AIDGSR: Integrated Circuit
USB = 1054500101: MN: *